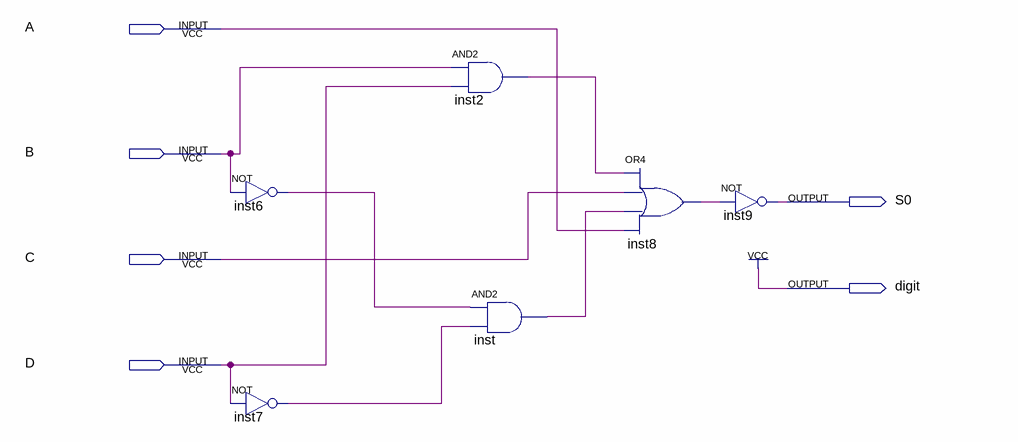
[diagram p0: schematic sheet]
// Quartus schematic dekoder.bdf as structural Verilog: 6 symbols, 6 pins
module dekoder (
  input  A,
  input  B,
  input  C,
  input  D,
  output S0,
  output digit
);

  wire inst2_out, inst6_out, inst7_out, inst8_out, inst_out;

  not inst6 (inst6_out, B);
  not inst7 (inst7_out, D);
  and inst2 (inst2_out, B, D);
  and inst (inst_out, inst6_out, inst7_out);
  or inst8 (inst8_out, inst2_out, C, inst_out, A);
  not inst9 (S0, inst8_out);

  assign digit = 1'b1;
endmodule
